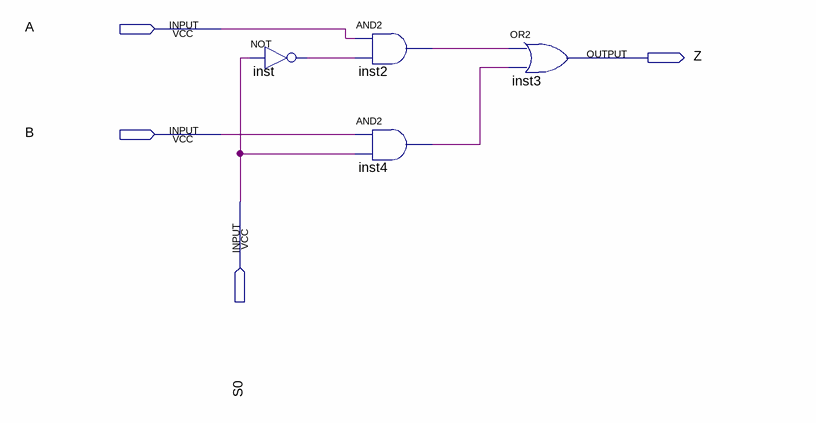
[diagram p0: schematic sheet]
// Quartus schematic mux21.bdf as structural Verilog: 4 symbols, 4 pins
module mux21 (
  input  A,
  input  B,
  input  S0,
  output Z
);

  wire inst2_out, inst4_out, inst_out;

  not inst (inst_out, S0);
  and inst2 (inst2_out, A, inst_out);
  and inst4 (inst4_out, B, S0);
  or inst3 (Z, inst2_out, inst4_out);
endmodule
